# Altium schematic sheet Main.SchDoc
size A3; DocumentNumber: 1; SheetNumber: 1; SheetTotal: 16
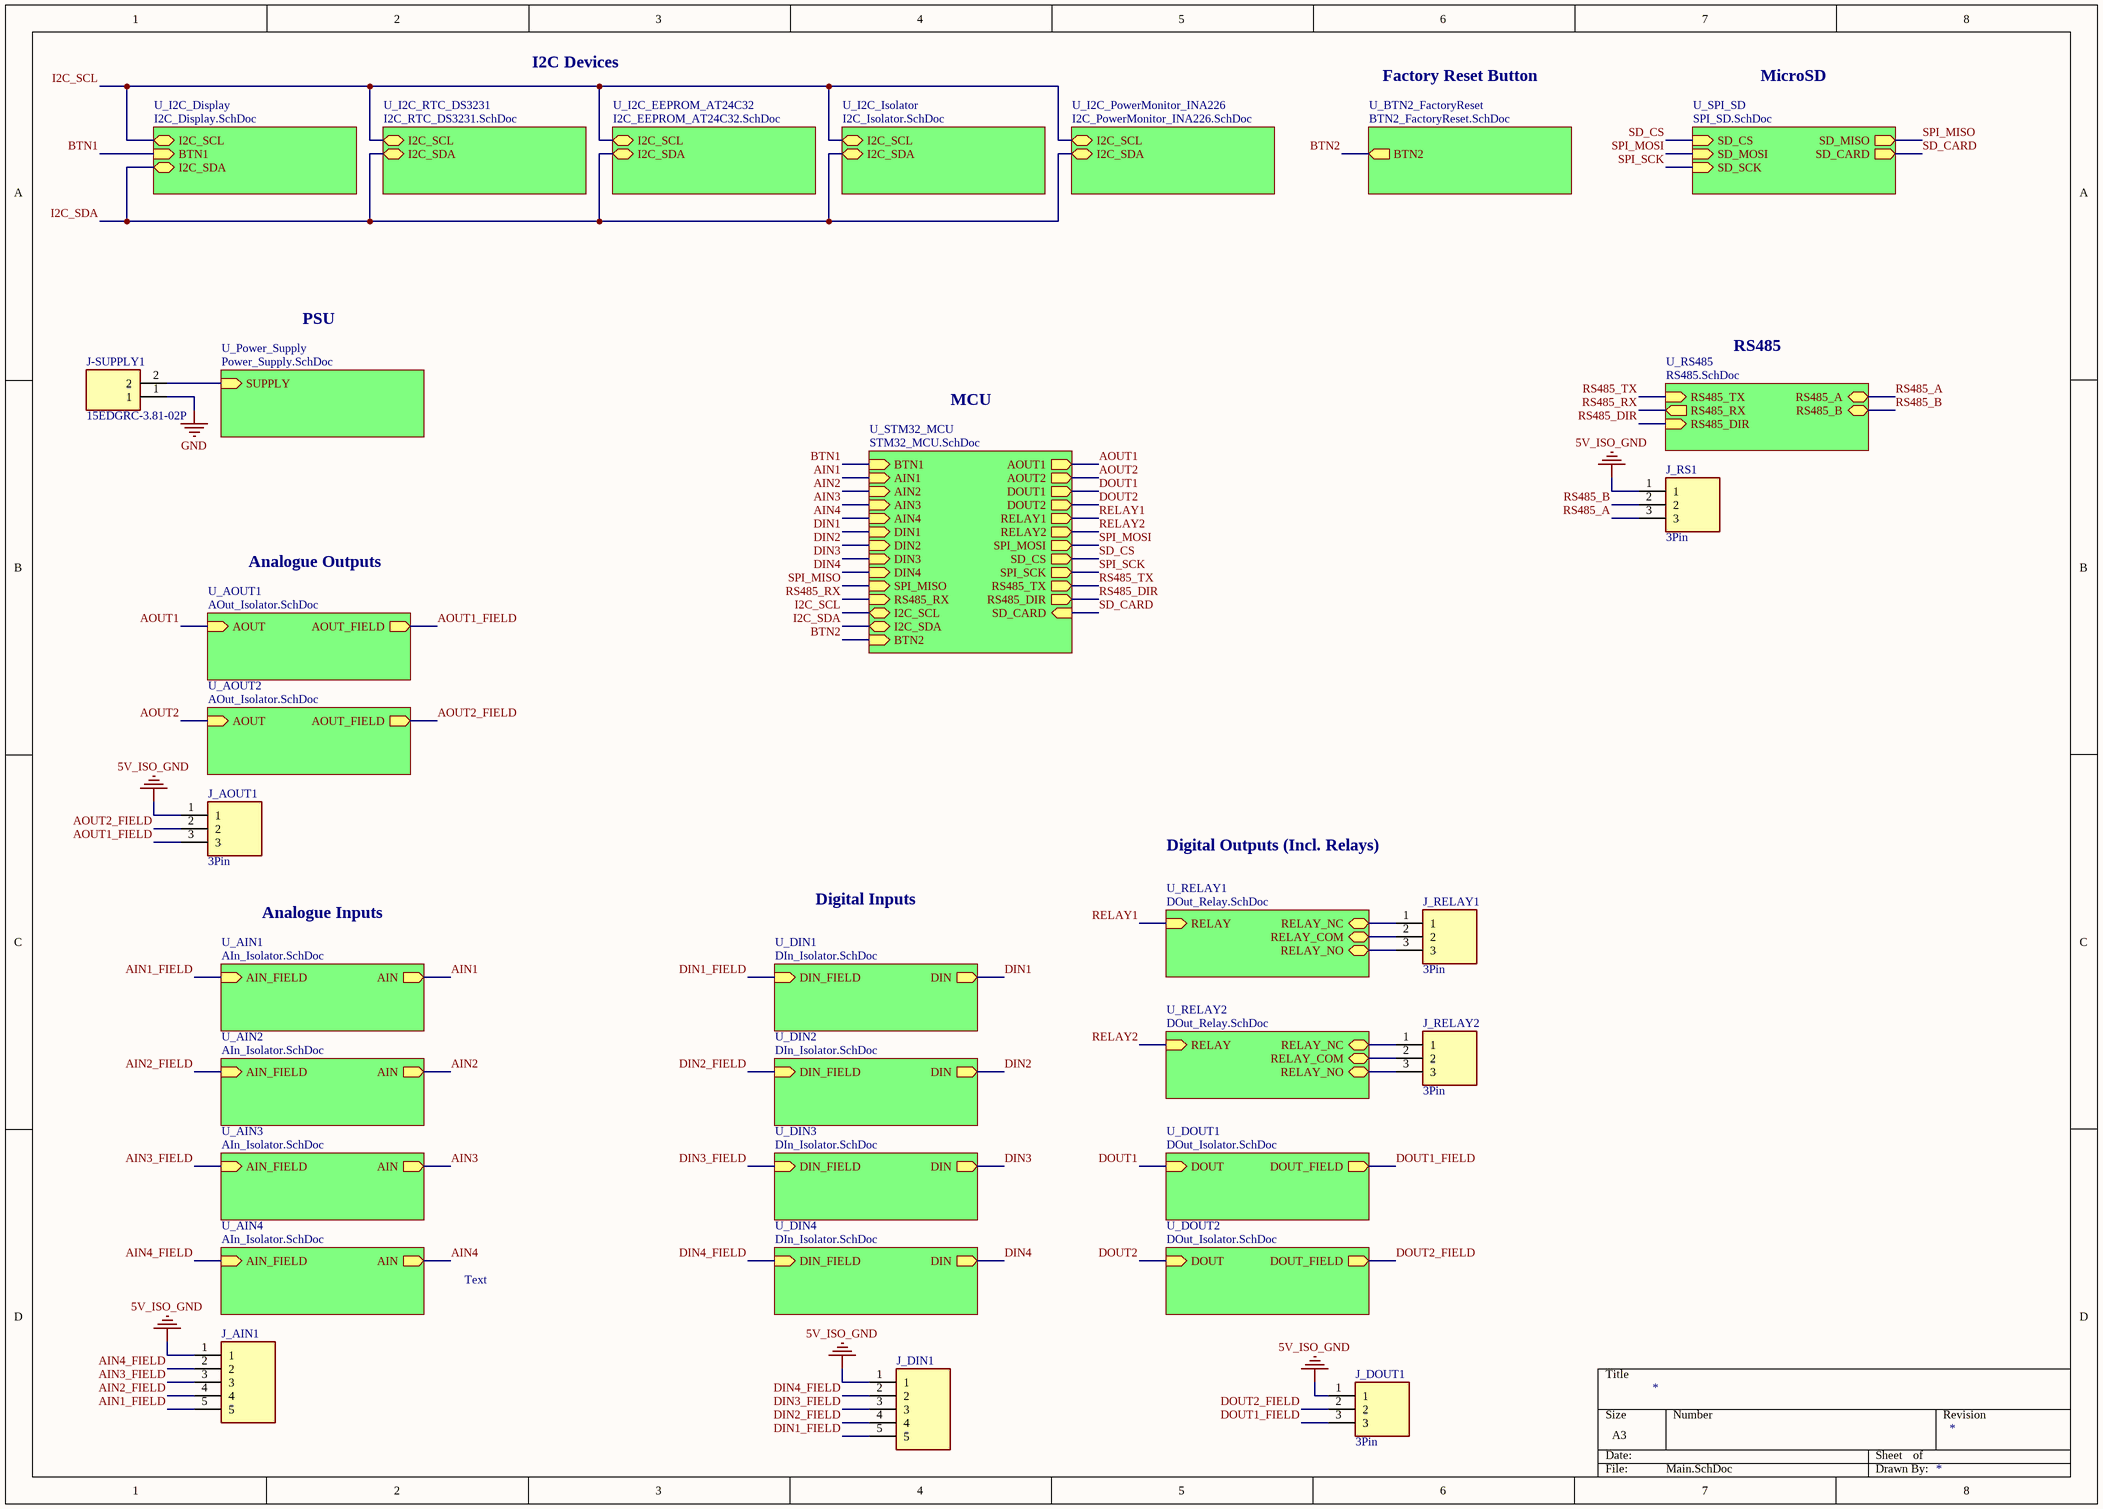
[diagram p0: Main.SchDoc]

## Parts
J-SUPPLY1  15EDGRC-3.81-02P  [15EDGRC-3.81-02P]
J_AIN1  (no value)  [15EDGRC-3.81-05P]
J_AOUT1  3Pin  [15EDGRC-3.81-03P]
J_DIN1  (no value)  [15EDGRC-3.81-05P]
J_DOUT1  3Pin  [15EDGRC-3.81-03P]
J_RELAY1  3Pin  [15EDGRC-3.81-03P]
J_RELAY2  3Pin  [15EDGRC-3.81-03P]
J_RS1  3Pin  [15EDGRC-3.81-03P]

## Sub-sheets
U_AIN1 = AIn_Isolator.SchDoc: AIN (out), AIN_FIELD (in)
U_AIN2 = AIn_Isolator.SchDoc: AIN (out), AIN_FIELD (in)
U_AIN3 = AIn_Isolator.SchDoc: AIN (out), AIN_FIELD (in)
U_AIN4 = AIn_Isolator.SchDoc: AIN (out), AIN_FIELD (in)
U_AOUT1 = AOut_Isolator.SchDoc: AOUT_FIELD (out), AOUT (in)
U_AOUT2 = AOut_Isolator.SchDoc: AOUT_FIELD (out), AOUT (in)
U_BTN2_FactoryReset = BTN2_FactoryReset.SchDoc: BTN2 (out)
U_DIN1 = DIn_Isolator.SchDoc: DIN_FIELD (in), DIN (out)
U_DIN2 = DIn_Isolator.SchDoc: DIN_FIELD (in), DIN (out)
U_DIN3 = DIn_Isolator.SchDoc: DIN_FIELD (in), DIN (out)
U_DIN4 = DIn_Isolator.SchDoc: DIN_FIELD (in), DIN (out)
U_DOUT1 = DOut_Isolator.SchDoc: DOUT (in), DOUT_FIELD (out)
U_DOUT2 = DOut_Isolator.SchDoc: DOUT (in), DOUT_FIELD (out)
U_I2C_Display = I2C_Display.SchDoc: I2C_SCL (bidir), I2C_SDA (bidir), BTN1 (in)
U_I2C_EEPROM_AT24C32 = I2C_EEPROM_AT24C32.SchDoc: I2C_SCL (bidir), I2C_SDA (bidir)
U_I2C_Isolator = I2C_Isolator.SchDoc: I2C_SCL (bidir), I2C_SDA (bidir)
U_I2C_PowerMonitor_INA226 = I2C_PowerMonitor_INA226.SchDoc: I2C_SCL (bidir), I2C_SDA (bidir)
U_I2C_RTC_DS3231 = I2C_RTC_DS3231.SchDoc: I2C_SDA (bidir), I2C_SCL (bidir)
U_Power_Supply = Power_Supply.SchDoc: SUPPLY (in)
U_RELAY1 = DOut_Relay.SchDoc: RELAY (in), RELAY_NO (bidir), RELAY_NC (bidir), RELAY_COM (bidir)
U_RELAY2 = DOut_Relay.SchDoc: RELAY (in), RELAY_NO (bidir), RELAY_NC (bidir), RELAY_COM (bidir)
U_RS485 = RS485.SchDoc: RS485_RX (out), RS485_TX (in), RS485_DIR (in), RS485_A (bidir), RS485_B (bidir)
U_SPI_SD = SPI_SD.SchDoc: SD_CS (in), SD_MOSI (in), SD_SCK (in), SD_MISO (out), SD_CARD (out)
U_STM32_MCU = STM32_MCU.SchDoc: BTN1 (in), AIN1 (in), AIN2 (in), AIN3 (in), AIN4 (in), DIN1 (in), DIN2 (in), DIN3 (in), DIN4 (in), AOUT1 (out), AOUT2 (out), DOUT1 (out), DOUT2 (out), RELAY1 (out), RELAY2 (out), SPI_MISO (in), SPI_MOSI (out), SD_CS (out), SPI_SCK (out), RS485_TX (out), RS485_RX (in), RS485_DIR (out), I2C_SCL (bidir), I2C_SDA (bidir), BTN2 (in), SD_CARD (in)

## Nets
5V_ISO_GND: J_AIN1.1 J_AOUT1.1 J_DIN1.1 J_DOUT1.1 J_RS1.1
GND: J-SUPPLY1.1
AIN1: sheet U_AIN1/AIN, sheet U_STM32_MCU/AIN1
AIN1_FIELD: J_AIN1.5 ; sheet U_AIN1/AIN_FIELD
AIN2: sheet U_AIN2/AIN, sheet U_STM32_MCU/AIN2
AIN2_FIELD: J_AIN1.4 ; sheet U_AIN2/AIN_FIELD
AIN3: sheet U_AIN3/AIN, sheet U_STM32_MCU/AIN3
AIN3_FIELD: J_AIN1.3 ; sheet U_AIN3/AIN_FIELD
AIN4: sheet U_AIN4/AIN, sheet U_STM32_MCU/AIN4
AIN4_FIELD: J_AIN1.2 ; sheet U_AIN4/AIN_FIELD
AOUT1: sheet U_AOUT1/AOUT, sheet U_STM32_MCU/AOUT1
AOUT1_FIELD: J_AOUT1.3 ; sheet U_AOUT1/AOUT_FIELD
AOUT2: sheet U_AOUT2/AOUT, sheet U_STM32_MCU/AOUT2
AOUT2_FIELD: J_AOUT1.2 ; sheet U_AOUT2/AOUT_FIELD
BTN1: sheet U_I2C_Display/BTN1, sheet U_STM32_MCU/BTN1
BTN2: sheet U_BTN2_FactoryReset/BTN2, sheet U_STM32_MCU/BTN2
DIN1: sheet U_STM32_MCU/DIN1, sheet U_DIN1/DIN
DIN1_FIELD: J_DIN1.5 ; sheet U_DIN1/DIN_FIELD
DIN2: sheet U_STM32_MCU/DIN2, sheet U_DIN2/DIN
DIN2_FIELD: J_DIN1.4 ; sheet U_DIN2/DIN_FIELD
DIN3: sheet U_STM32_MCU/DIN3, sheet U_DIN3/DIN
DIN3_FIELD: J_DIN1.3 ; sheet U_DIN3/DIN_FIELD
DIN4: sheet U_STM32_MCU/DIN4, sheet U_DIN4/DIN
DIN4_FIELD: J_DIN1.2 ; sheet U_DIN4/DIN_FIELD
DOUT1: sheet U_STM32_MCU/DOUT1, sheet U_DOUT1/DOUT
DOUT1_FIELD: J_DOUT1.3 ; sheet U_DOUT1/DOUT_FIELD
DOUT2: sheet U_STM32_MCU/DOUT2, sheet U_DOUT2/DOUT
DOUT2_FIELD: J_DOUT1.2 ; sheet U_DOUT2/DOUT_FIELD
I2C_SCL: sheet U_I2C_Display/I2C_SCL, sheet U_I2C_EEPROM_AT24C32/I2C_SCL, sheet U_I2C_RTC_DS3231/I2C_SCL, sheet U_I2C_Isolator/I2C_SCL, sheet U_STM32_MCU/I2C_SCL, sheet U_I2C_PowerMonitor_INA226/I2C_SCL
I2C_SDA: sheet U_I2C_Display/I2C_SDA, sheet U_I2C_EEPROM_AT24C32/I2C_SDA, sheet U_I2C_RTC_DS3231/I2C_SDA, sheet U_I2C_Isolator/I2C_SDA, sheet U_STM32_MCU/I2C_SDA, sheet U_I2C_PowerMonitor_INA226/I2C_SDA
RELAY1: sheet U_STM32_MCU/RELAY1, sheet U_RELAY1/RELAY
RELAY2: sheet U_STM32_MCU/RELAY2, sheet U_RELAY2/RELAY
RS485_A: J_RS1.3 ; sheet U_RS485/RS485_A
RS485_B: J_RS1.2 ; sheet U_RS485/RS485_B
RS485_DIR: sheet U_RS485/RS485_DIR, sheet U_STM32_MCU/RS485_DIR
RS485_RX: sheet U_RS485/RS485_RX, sheet U_STM32_MCU/RS485_RX
RS485_TX: sheet U_RS485/RS485_TX, sheet U_STM32_MCU/RS485_TX
SD_CARD: sheet U_STM32_MCU/SD_CARD, sheet U_SPI_SD/SD_CARD
SD_CS: sheet U_STM32_MCU/SD_CS, sheet U_SPI_SD/SD_CS
SPI_MISO: sheet U_STM32_MCU/SPI_MISO, sheet U_SPI_SD/SD_MISO
SPI_MOSI: sheet U_STM32_MCU/SPI_MOSI, sheet U_SPI_SD/SD_MOSI
SPI_SCK: sheet U_STM32_MCU/SPI_SCK, sheet U_SPI_SD/SD_SCK
NetJ-SUPPLY1_2: J-SUPPLY1.2 ; sheet U_Power_Supply/SUPPLY
NetJ_RELAY1_1: J_RELAY1.1 ; sheet U_RELAY1/RELAY_NC
NetJ_RELAY1_2: J_RELAY1.2 ; sheet U_RELAY1/RELAY_COM
NetJ_RELAY1_3: J_RELAY1.3 ; sheet U_RELAY1/RELAY_NO
NetJ_RELAY2_1: J_RELAY2.1 ; sheet U_RELAY2/RELAY_NC
NetJ_RELAY2_2: J_RELAY2.2 ; sheet U_RELAY2/RELAY_COM
NetJ_RELAY2_3: J_RELAY2.3 ; sheet U_RELAY2/RELAY_NO

## Notes on the sheet
- I2C Devices
- Factory Reset Button
- MicroSD
- PSU
- RS485
- MCU
- Analogue Outputs
- Digital Outputs (Incl. Relays)
- Analogue Inputs
- Digital Inputs
- Text

## Library data of the parts
J-SUPPLY1 = 15EDGRC-3.81-02P: Manufacturer_Name: Degson; Manufacturer_Part_Number: 15EDGRC-3.81-02P-14-00A(H); Geometry.Height: 7.2mm; Mouser Part Number: *; Mouser Price/Stock: *; Arrow Part Number: *; Arrow Price/Stock: *; Datasheet Link: https://www.tme.com/uz/ru/details/15edgrc3.81-02p/klemmnye-kolodki-razemnogo-tipa/degson-electronics/15edgrc-3-81-02p-14-00a-h/
J_AIN1 J_DIN1 = 15EDGRC-3.81-05P: Manufacturer_Name: Degson; Manufacturer_Part_Number: 15EDGRC-3.81-02P-14-00A(H); Geometry.Height: 7.2mm; Mouser Part Number: *; Mouser Price/Stock: *; Arrow Part Number: *; Arrow Price/Stock: *; Datasheet Link: https://www.tme.com/uz/ru/details/15edgrc3.81-02p/klemmnye-kolodki-razemnogo-tipa/degson-electronics/15edgrc-3-81-02p-14-00a-h/
J_AOUT1 J_DOUT1 J_RELAY1 J_RELAY2 J_RS1 = 15EDGRC-3.81-03P: Manufacturer_Name: Degson; Manufacturer_Part_Number: 15EDGRC-3.81-02P-14-00A(H); Geometry.Height: 7.2mm; Mouser Part Number: *; Mouser Price/Stock: *; Arrow Part Number: *; Arrow Price/Stock: *; Datasheet Link: https://www.tme.com/uz/ru/details/15edgrc3.81-02p/klemmnye-kolodki-razemnogo-tipa/degson-electronics/15edgrc-3-81-02p-14-00a-h/